# Altium schematic sheet E1706R_Schematic_1.SchDoc
size B; SheetNumber: 2; SheetTotal: 2
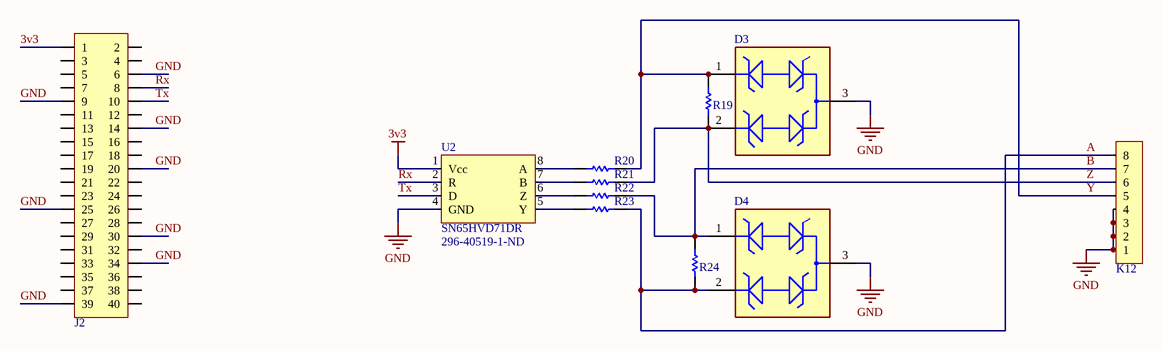
[diagram p0: E1706R_Schematic_1.SchDoc]

## Parts
D3  CDSOT23-SM712  [FP-SOT23-MFG]  (value not drawn)
D4  CDSOT23-SM712  [FP-SOT23-MFG]  (value not drawn)
J2  2223  [2223]  (value not drawn)
K12  6339191-5  [6339191-5]  (value not drawn)
R19  Res_120_0805  [RESC2012N]  (value not drawn)
R20  Res_10_0805  [RESC2012N]  (value not drawn)
R21  Res_10_0805  [RESC2012N]  (value not drawn)
R22  Res_10_0805  [RESC2012N]  (value not drawn)
R23  Res_10_0805  [RESC2012N]  (value not drawn)
R24  Res_120_0805  [RESC2012N]  (value not drawn)
U2  SN65HVD71DR  Supplier Part Number 1: 296-40519-1-ND  [SN65HVD71DR]

## Nets
3v3: J2.1 U2.1(Vcc)
GND: D3.3 D4.3 J2.6 J2.9 J2.14 J2.20 J2.25 J2.30 J2.34 J2.39 K12.1 K12.2 K12.3 K12.4 U2.4(GND)
A: D4.2 K12.8 R23.2 R24.1
B: D4.1 K12.7 R22.2 R24.2
Rx: J2.8 U2.2(R)
Tx: J2.10 U2.3(D)
Y: D3.1 K12.5 R19.2 R20.2
Z: D3.2 K12.6 R19.1 R21.2
NetR20_1: R20.1 U2.8(A)
NetR21_1: R21.1 U2.7(B)
NetR22_1: R22.1 U2.6(Z)
NetR23_1: R23.1 U2.5(Y)

Not connected (* = marked no-connect by the designer): J2 2 3 4 5 7 11 12 13 15 16 17 18 19 21 22 23 24 26 27 28 29 31 32 33 35 36 37 38 40

## Library data of the parts
D3 D4 = CMP-2000-05081-2: TVS DIODE 7V/12V 14V/26V SOT23-3; Manufacturer: Bourns Inc.; Peak Pulse Current: 17A; Standoff Height: 0.05mm; Breakdown Voltage: 7.5V; Direction: Bidirectional; Clamping Voltage: 26V; Value: 75pF; Number Of Channels: 2; Reverse Standoff Voltage: 12V; Peak Pulse Power: 400W; Max Surge Current: 30A; Polarity: Bidirectional,Unidirectional; Min Breakdown Voltage: 13.3V; Power Line Protection: No; Leakage Current: 20uA; Element Configuration: Dual; Diode Type: ZENER; Max Power Dissipation: 600W; Test Current: 1mA; ESD Protection: Yes; Temperature Range Low: -55°C; Mouser Description: Transient Voltage Suppressor, TVS, CDSOT23 Series, Unidirectional, 12 V, SOT-23, 3, 13.3 V; Device Class L3: unset; Package: SOT23; Height: 1.17mm; RoHS: TRUE; Octopart: https://octopart.com/cdsot23-sm712-bourns-7576327; Category: Diode; Ipc Land Pattern Name: SOT95P229X103-3; ComponentLink2URL: https://www.bourns.com/docs/Product-Datasheets/CDSOT23-SM712.pdf; Temperature Range High: +150°C; ComponentLink2Description: Datasheet; Digikey Description: TVS DIODE 7V/12V 14V/26V SOT23-3; Manufacturer Part Number: CDSOT23-SM712; Temperature: -55°C to +150°C; Device Class L2: TVS Diodes; Lead Free: Yes; Device Class L1: Circuit Protection; Automotive: No; Capacitance: 75pF; Supplier 1: Digi-Key; Supplier Part Number 1: CDSOT23-SM712CT-ND; Stock 1: 37537; Pricing 1: 1=1.63000, 10=1.46000, 100=1.13850, 500=0.94050, 1000=0.74250 (USD); Mount: Surface Mount; Case/Package: SOT-23; Number of Pins: 3; Contact Plating: Tin; Min Operating Temperature: -55°C; Max Operating Temperature: 150°C; Packaging: Tape and Reel; Package Quantity: 1; Series: -; Working Voltage: 12V; Termination: SMD/SMT; Resistor Type: Zener; Number of Elements: 2; Reverse Breakdown Voltage: 13.3V; Number of Bidirectional Channels: 2; Power Dissipation: 400W; Max Reverse Leakage Current: 20uA; Max Breakdown Voltage: 13.3V; Length: 3.04mm; Width: 0.055inch; Depth: 1.4mm; Radiation Hardening: No; REACH SVHC: No SVHC; RoHS Compliant: Yes; ComponentLink1URL: https://datasheet.ciiva.com/1281/1670933-1281331.pdf?src-supplier=Farnell; ComponentLink1Description: https://datasheet.ciiva.com/1281/1670933-1281331.pdf?src-supplier=Farnell; ComponentLink3URL: https://datasheet.ciiva.com/4510/cdsot23-sm712-25932-4510261.pdf?src-supplier=Mouser; ComponentLink3Description: https://datasheet.ciiva.com/4510/cdsot23-sm712-25932-4510261.pdf?src-supplier=Mouser; ComponentLink4URL: https://datasheet.ciiva.com/11193/cdsot23-sm712-11193846.pdf?src-supplier=Avnet; ComponentLink4Description: https://datasheet.ciiva.com/11193/cdsot23-sm712-11193846.pdf?src-supplier=Avnet; ComponentLink5URL: https://datasheet.ciiva.com/16582/cdsot23-sm712-16582189.pdf?src-supplier=Avnet+Europe; ComponentLink5Description: https://datasheet.ciiva.com/16582/cdsot23-sm712-16582189.pdf?src-supplier=Avnet+Europe; ComponentLink6URL: https://datasheet.ciiva.com/337/cdsot23-sm712-337451.pdf?src-supplier=Digi-Key; ComponentLink6Description: https://datasheet.ciiva.com/337/cdsot23-sm712-337451.pdf?src-supplier=Digi-Key; ComponentLink7URL: https://datasheet.ciiva.com/337/cdsot23-sm712-337452.pdf?src-supplier=Digi-Key; ComponentLink7Description: https://datasheet.ciiva.com/337/cdsot23-sm712-337452.pdf?src-supplier=Digi-Key; ComponentLink8URL: https://datasheet.ciiva.com/26828/getdatasheetpartid-418501-26828522.pdf?src-supplier=Verical; ComponentLink8Description: https://datasheet.ciiva.com/26828/getdatasheetpartid-418501-26828522.pdf?src-supplier=Verical; ComponentLink9URL: https://datasheet.ciiva.com/22696/1670933-22696779.pdf?src-supplier=Element14; ComponentLink9Description: https://datasheet.ciiva.com/22696/1670933-22696779.pdf?src-supplier=Element14
J2 = 2223: 40 PIN 20X2 CONN
R19 R24 = Res_120_0805: RES 120 OHM 1/8W 1% 0805
R20-R23 = Res_10_0805: RES 10 OHM 1/8W 1% 0805; Manufacturer: Vishay Dale; Manufacturer P/N: CRCW080510R0FKEA; Power (Watts): 0.125W, 1/8W; Temperature Coefficient: ±100ppm/°C; Resistance (Ohms): 10; Supplier 1: Digi-Key; Supplier Part Number 1: 541-10.0CCT-ND; RoHS: RoHS Compliant; Composition: Thick Film; Features: Automotive AEC-Q200 Qualified; Tolerance: ±1%; Package / Case: 0805 (2012 Metric); ComponentLink1URL: http://www.vishay.com/doc?20035; ComponentLink1Description: Datasheet; Supplier 2: Digi-Key; Supplier Part Number 2: 541-10.0CTR-ND
U2 = SN65HVD71DR: Single Transmitter/Receiver RS-485 8-Pin SOIC T/R; Manufacturer: Texas Instruments; Data Rate: 400Kbps; Number of Transmitters: 1; Operating Supply Voltage: 3.3V; Simplex/Duplex: Full Duplex; Receiver Hysteresis: 70mV; Supplier 1: Digi-Key; Manufacturer Part Number: SN65HVD71DR; RoHS: Yes; Category: RS-232 / RS-422 / RS-485 Interface ICs; Stock 1: 1611; Pricing 1: 1=3.41000, 10=3.06300, 25=2.89520, 100=2.50930, 250=2.38064, 500=2.13616, 1000=2.12450 (USD); Mount: Surface Mount; Case/Package: SOIC; Number of Pins: 8; Min Operating Temperature: -40°C; Max Operating Temperature: 125°C; Packaging: Tape and Reel; Logic Function: Receiver; Lead Free: Lead Free; RoHS Compliant: Yes; ComponentLink1URL: https://datasheet.ciiva.com/48475/sn65hvd70-48475464.pdf?src-supplier=Avnet; ComponentLink1Description: https://datasheet.ciiva.com/48475/sn65hvd70-48475464.pdf?src-supplier=Avnet